# EAGLE design quantizer2_v10 (EAGLE 9.6.2)

## Sheet 1 of 2
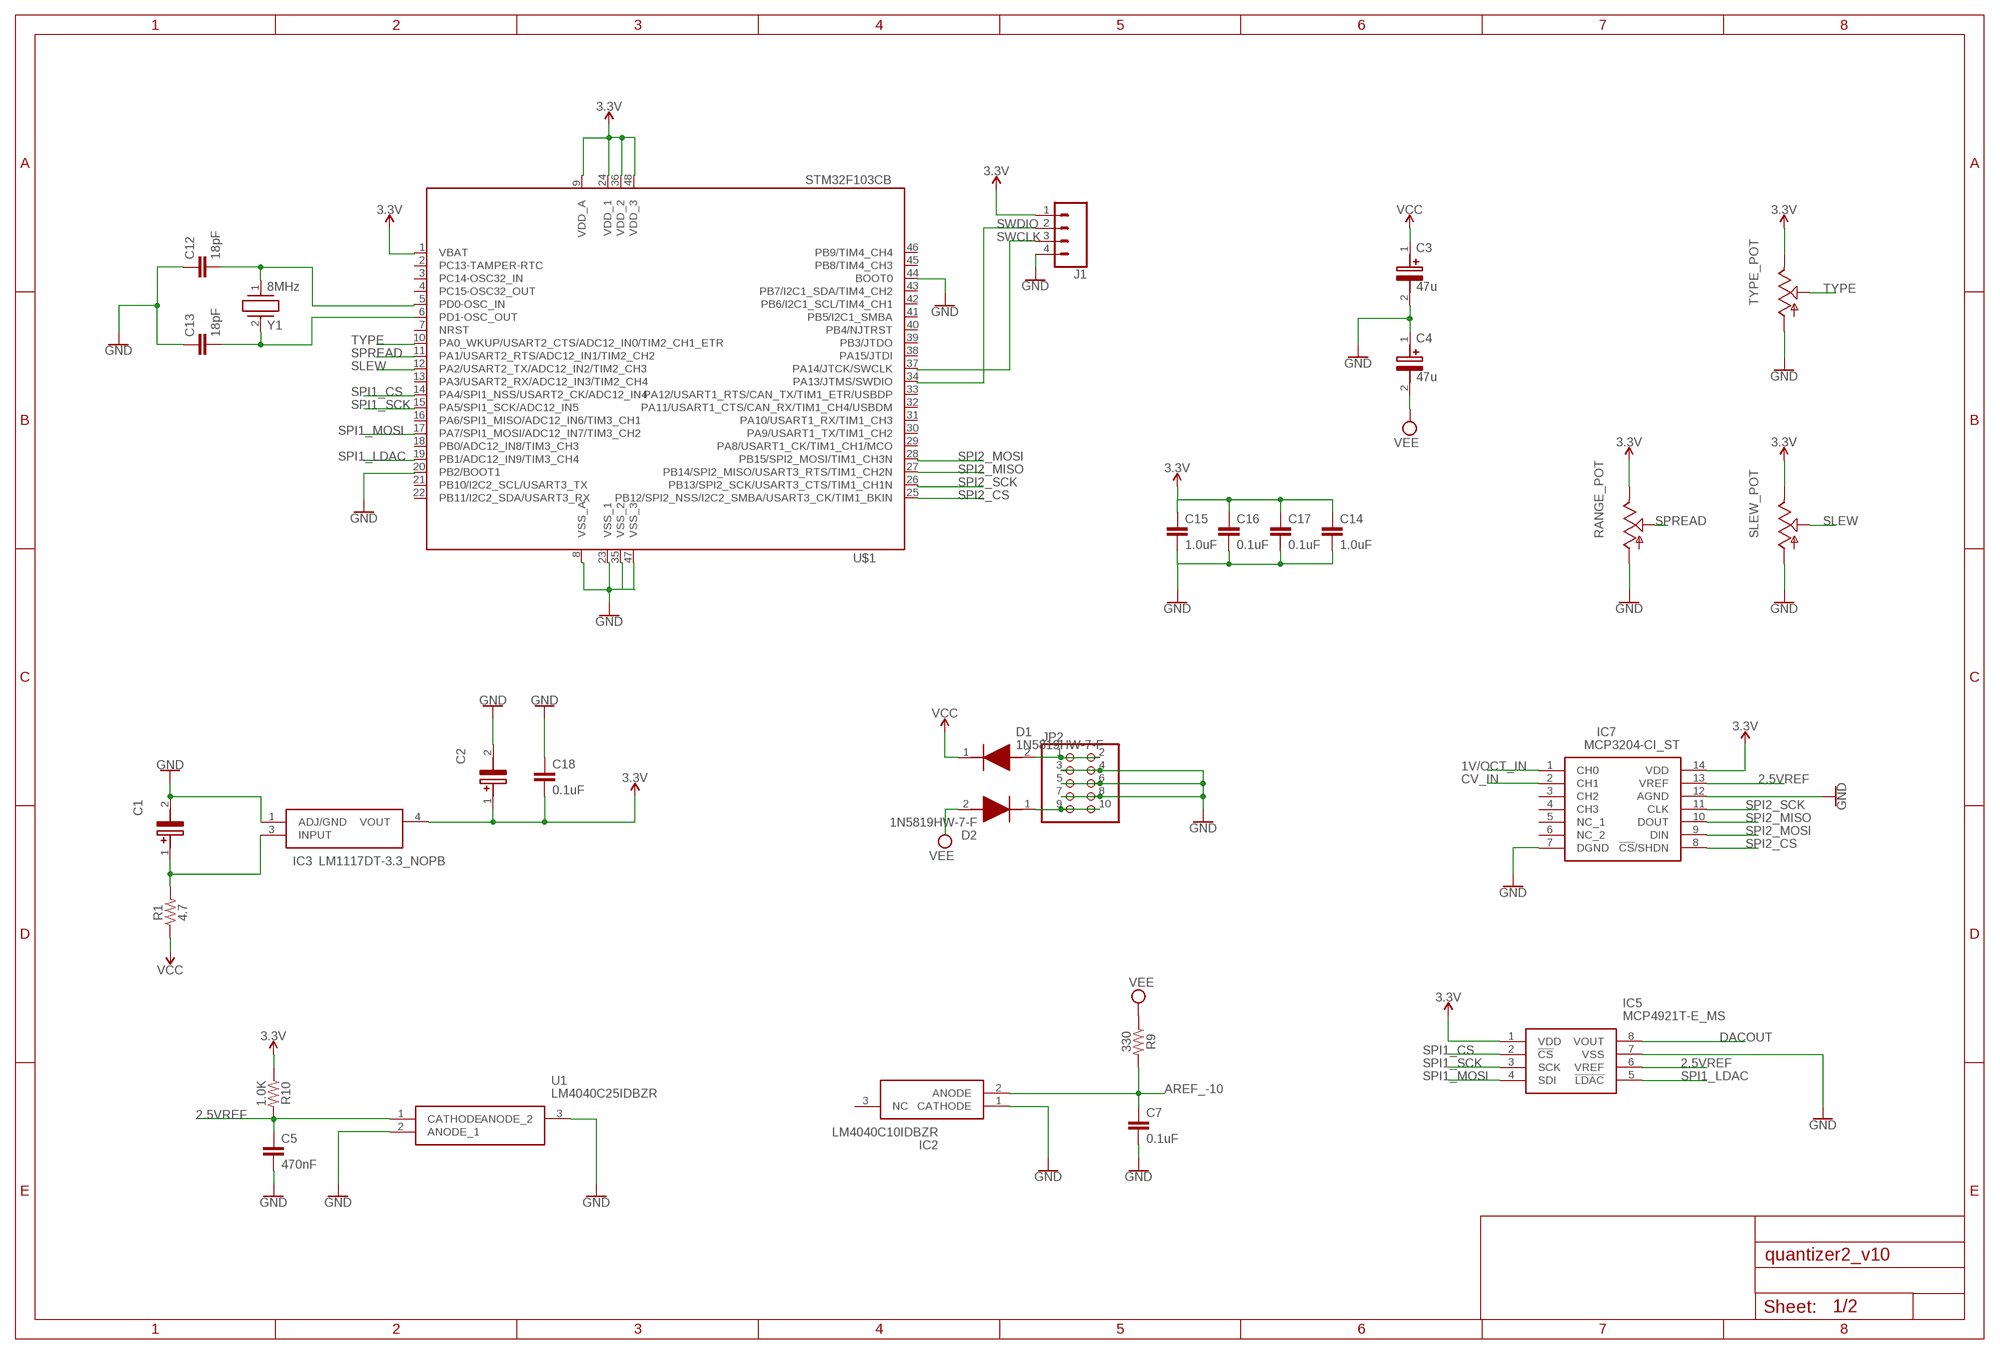
[diagram p0: schematic, sheet 1]

### Parts
C1  22uF  EEE-FP1E220AR  [EEE0GA101SR]
C2  22uF  EEE-FP1E220AR  [EEE0GA101SR]
C3  47u  EEE-FK1V470P  [EEE1AA101SP]
C4  47u  EEE-FK1V470P  [EEE1AA101SP]
C5  470nF  0.1UF-0603-25V-(+80/-20%)  [0603]
C7  0.1uF  0.1UF-0603-25V-(+80/-20%)  [0603]
C12  18pF  18PF-0603-50V-5%  [0603]
C13  18pF  18PF-0603-50V-5%  [0603]
C14  1.0uF  1.0UF-0603-16V-10%  [0603]
C15  1.0uF  1.0UF-0603-16V-10%  [0603]
C16  0.1uF  0.1UF-0603-25V-(+80/-20%)  [0603]
C17  0.1uF  0.1UF-0603-25V-(+80/-20%)  [0603]
C18  0.1uF  0.1UF-0603-25V-(+80/-20%)  [0603]
D1  1N5819HW-7-F  [SOD3716X145N]
D2  1N5819HW-7-F  [SOD3716X145N]
IC2  LM4040C10IDBZR  [SOT95P237X112-3N]
IC3  LM1117DT-3.3_NOPB  [TO228P991X238-3N]
IC5  MCP4921T-E_MS  [SOP65P490X110-8N]
IC7  MCP3204-CI_ST  [SOP65P640X120-14N]
J1  CONN_04  [1X04]
JP2  PINHD-2X5  [2X05]
R1  4.7  RESISTOR1206  [1206]
R9  330  RESISTOR0603  [0603]
R10  1.0K  RESISTOR0603  [0603]
RANGE_POT  POT_USVERTICAL_PS  [ALPS_POT_VERTICAL_PS]
SLEW_POT  POTENTIOMETER-ALPHA-9MM_VERTICAL_  [POTENTIOMETER-ALPHA-9MM_VERTICAL]
TYPE_POT  POT_USVERTICAL_PS  [ALPS_POT_VERTICAL_PS]
U1  LM4040C25IDBZR  [SOT95P237X112-3N]
U$1  STM32F103CB  [LQFP48]
Y1  8MHz  ABLS3-8.000MHZ-D4Y-T  [ABLS]

### Nets
1V/OCT_IN: IC7.1(CH0) ; also sheet 2
2.5VREF: C5.1 IC5.6(VREF) IC7.13(VREF) R10.2 U1.1(CATHODE)
3.3V: C2.1(+) C18.2 IC3.4(VOUT) IC5.1(VDD) IC7.14(VDD) J1.1 R10.1 RANGE_POT.P$1(E) SLEW_POT.3(E) TYPE_POT.P$1(E) U$1.1(VBAT) U$1.9(VDD_A) U$1.24(VDD_1) U$1.36(VDD_2) U$1.48(VDD_3)
AREF_-10: C7.1 IC2.2(ANODE) R9.2 ; also sheet 2
CV_IN: IC7.2(CH1)
DACOUT: IC5.8(VOUT) ; also sheet 2
GND: C1.2(-) C2.2(-) C3.2(-) C4.1(+) C5.2 C7.2 C12.1 C13.1 C18.1 IC2.1(CATHODE) IC3.1(ADJ/GND) IC5.7(VSS) IC7.7(DGND) IC7.12(AGND) J1.4 JP2.3 JP2.4 JP2.5 JP2.6 JP2.7 JP2.8 RANGE_POT.P$3(A) SLEW_POT.1(A) TYPE_POT.P$3(A) U1.2(ANODE_1) U1.3(ANODE_2) U$1.8(VSS_A) U$1.20(PB2/BOOT1) U$1.23(VSS_1) U$1.35(VSS_2) U$1.44(BOOT0) U$1.47(VSS_3) ; also sheet 2
N$2: C1.1(+) IC3.3(INPUT) R1.2
N$4: D1.2(A) JP2.1 JP2.2
N$6: D2.1(K) JP2.9 JP2.10
N$10: C12.2 U$1.5(PD0-OSC_IN) Y1.1
N$11: C13.2 U$1.6(PD1-OSC_OUT) Y1.2
N$12: C14.1 C15.1 C16.1 C17.1 ; supply symbol labelled 3.3V
N$14: C14.2 C15.2 C16.2 C17.2 ; supply symbol labelled GND
SLEW: SLEW_POT.2(S) U$1.12(PA2/USART2_TX/ADC12_IN2/TIM2_CH3)
SPI1_CS: IC5.2(!CS) U$1.14(PA4/SPI1_NSS/USART2_CK/ADC12_IN4)
SPI1_LDAC: IC5.5(!LDAC) U$1.19(PB1/ADC12_IN9/TIM3_CH4)
SPI1_MOSI: IC5.4(SDI) U$1.17(PA7/SPI1_MOSI/ADC12_IN7/TIM3_CH2)
SPI1_SCK: IC5.3(SCK) U$1.15(PA5/SPI1_SCK/ADC12_IN5)
SPI2_CS: IC7.8(!CS!/SHDN) U$1.25(PB12/SPI2_NSS/I2C2_SMBA/USART3_CK/TIM1_BKIN)
SPI2_MISO: IC7.10(DOUT) U$1.27(PB14/SPI2_MISO/USART3_RTS/TIM1_CH2N)
SPI2_MOSI: IC7.9(DIN) U$1.28(PB15/SPI2_MOSI/TIM1_CH3N)
SPI2_SCK: IC7.11(CLK) U$1.26(PB13/SPI2_SCK/USART3_CTS/TIM1_CH1N)
SPREAD: RANGE_POT.P$2(S) U$1.11(PA1/USART2_RTS/ADC12_IN1/TIM2_CH2)
SWCLK: J1.3 U$1.37(PA14/JTCK/SWCLK)
SWDIO: J1.2 U$1.34(PA13/JTMS/SWDIO)
TYPE: TYPE_POT.P$2(S) U$1.10(PA0_WKUP/USART2_CTS/ADC12_IN0/TIM2_CH1_ETR)
VCC: C3.1(+) D1.1(K) R1.1 ; also sheet 2
VEE: C4.2(-) D2.2(A) R9.1 ; also sheet 2
Unconnected: IC2.3(NC) IC7.3(CH2) IC7.4(CH3) IC7.5(NC_1) IC7.6(NC_2) U$1.2(PC13-TAMPER-RTC) U$1.3(PC14-OSC32_IN) U$1.4(PC15-OSC32_OUT) U$1.7(NRST) U$1.13(PA3/USART2_RX/ADC12_IN3/TIM2_CH4) U$1.16(PA6/SPI1_MISO/ADC12_IN6/TIM3_CH1) U$1.18(PB0/ADC12_IN8/TIM3_CH3) U$1.21(PB10/I2C2_SCL/USART3_TX) U$1.22(PB11/I2C2_SDA/USART3_RX) U$1.29(PA8/USART1_CK/TIM1_CH1/MCO) U$1.30(PA9/USART1_TX/TIM1_CH2) U$1.31(PA10/USART1_RX/TIM1_CH3) U$1.32(PA11/USART1_CTS/CAN_RX/TIM1_CH4/USBDM) U$1.33(PA12/USART1_RTS/CAN_TX/TIM1_ETR/USBDP) U$1.38(PA15/JTDI) U$1.39(PB3/JTDO) U$1.40(PB4/NJTRST) U$1.41(PB5/I2C1_SMBA) U$1.42(PB6/I2C1_SCL/TIM4_CH1) U$1.43(PB7/I2C1_SDA/TIM4_CH2) U$1.45(PB8/TIM4_CH3) U$1.46(PB9/TIM4_CH4)

## Sheet 2 of 2
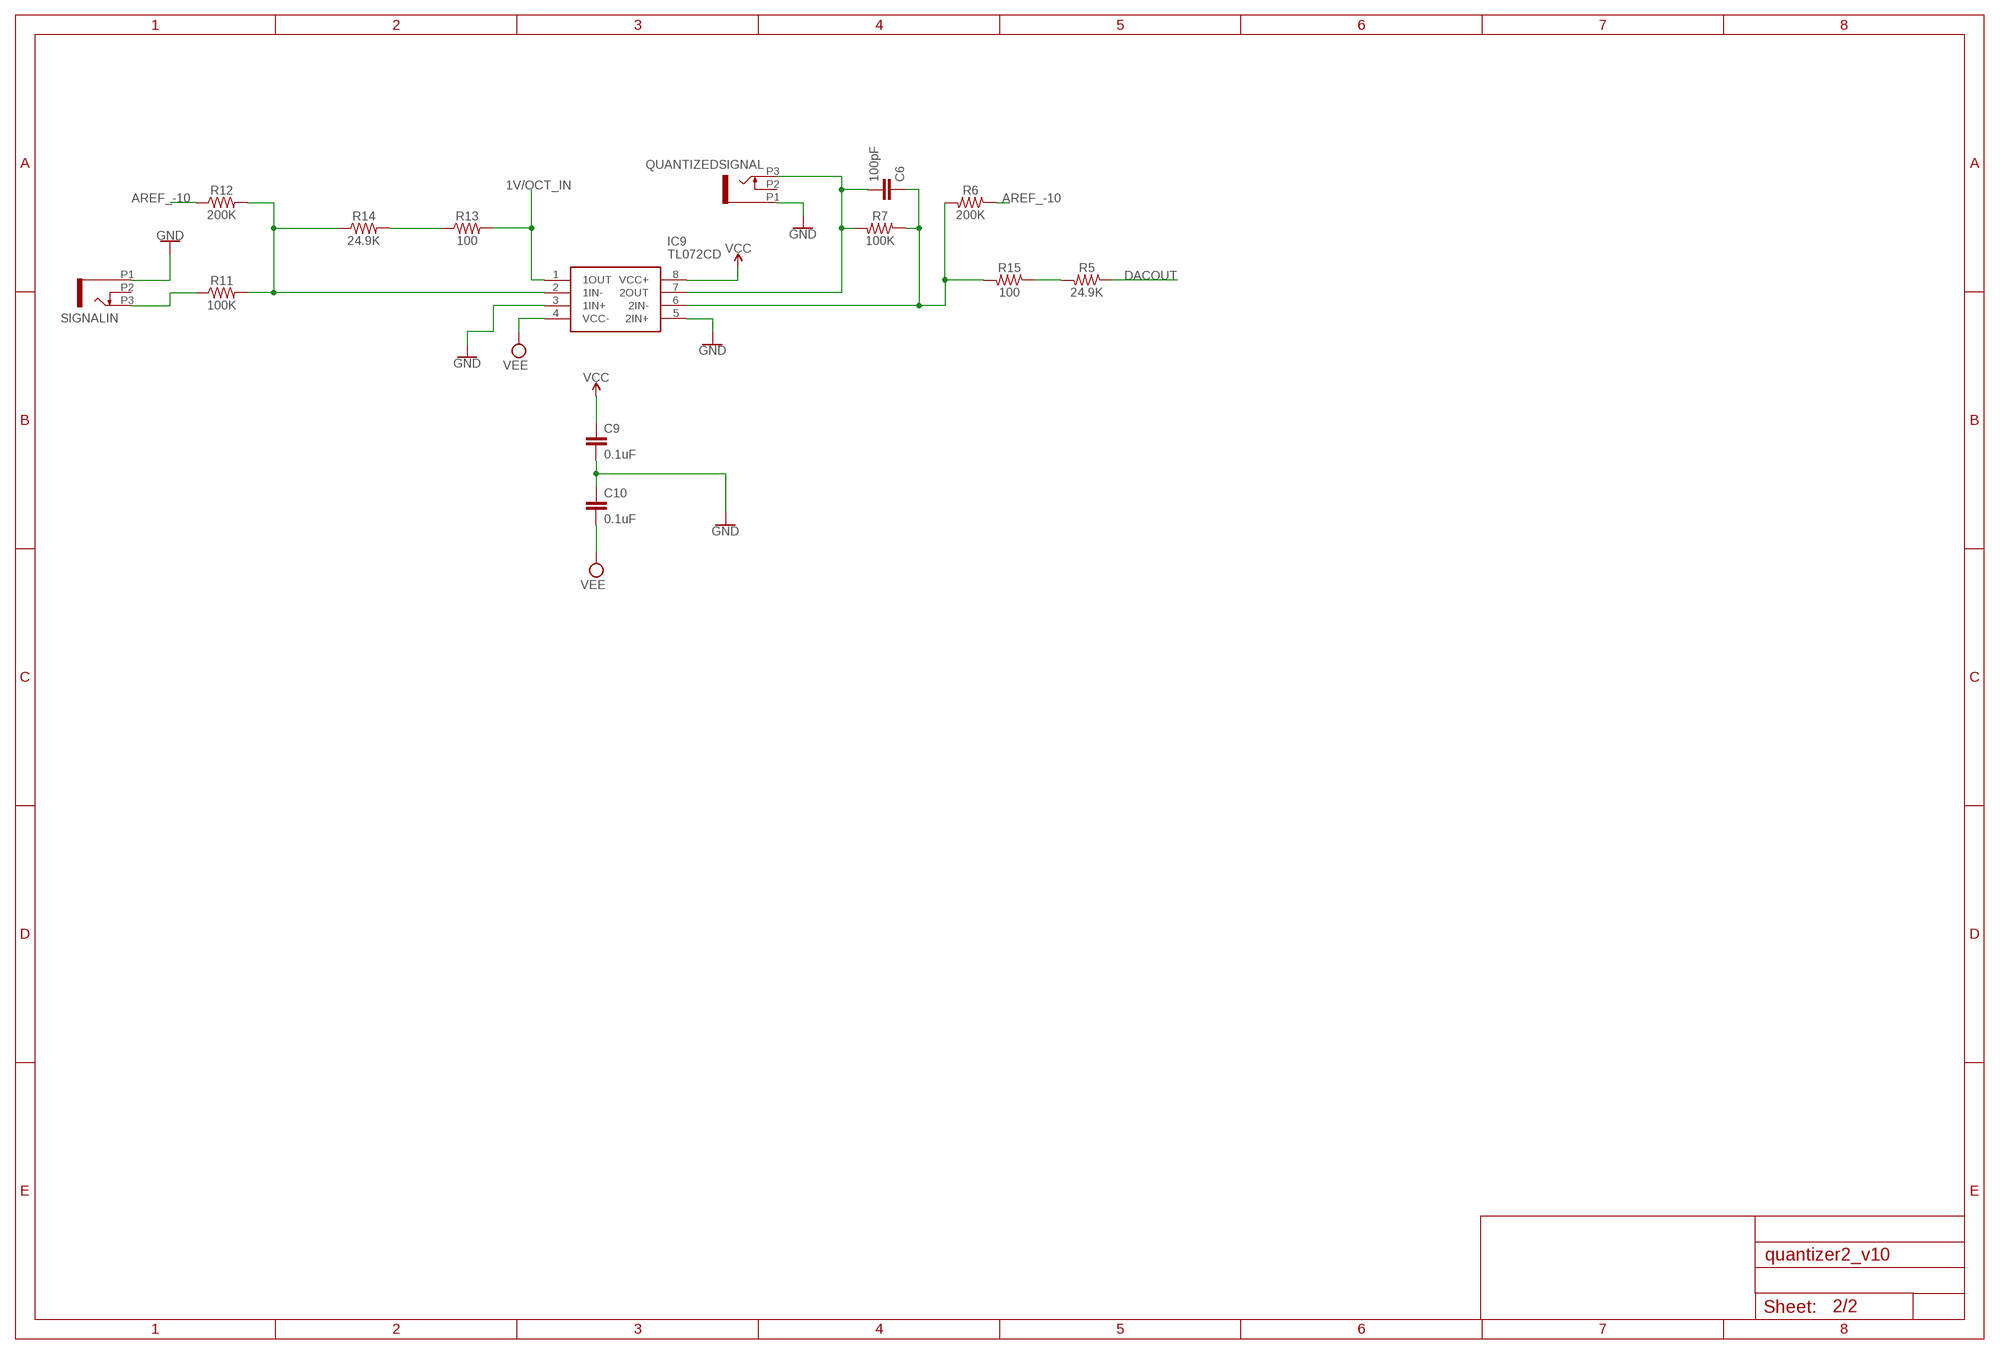
[diagram p1: schematic, sheet 2]

### Parts
C6  100pF  0.1UF-0603-25V-(+80/-20%)  [0603]
C9  0.1uF  0.1UF-0603-25V-(+80/-20%)  [0603]
C10  0.1uF  0.1UF-0603-25V-(+80/-20%)  [0603]
IC9  TL072CD  [SOIC127P600X175-8N]
QUANTIZEDSIGNAL  PJ301_THONKICONN6  [WQP_PJ_301M6]
R5  24.9K  RESISTOR0603  [0603]
R6  200K  RESISTOR0603  [0603]
R7  100K  RESISTOR0603  [0603]
R11  100K  RESISTOR0603  [0603]
R12  200K  RESISTOR0603  [0603]
R13  100  RESISTOR0603  [0603]
R14  24.9K  RESISTOR0603  [0603]
R15  100  RESISTOR0603  [0603]
SIGNALIN  PJ301_THONKICONN6  [WQP_PJ_301M6]

### Nets
1V/OCT_IN: IC9.1(1OUT) R13.2 ; also sheet 1
AREF_-10: R6.1 R12.1 ; also sheet 1
DACOUT: R5.1 ; also sheet 1
GND: C9.2 C10.1 IC9.3(1IN+) IC9.5(2IN+) QUANTIZEDSIGNAL.P1 SIGNALIN.P1 ; also sheet 1
N$5: R11.1 SIGNALIN.P3
N$8: IC9.2(1IN-) R11.2 R12.2 R14.1
N$13: C6.2 IC9.7(2OUT) QUANTIZEDSIGNAL.P3 R7.2
N$15: R13.1 R14.2
N$16: R5.2 R15.1
N$17: C6.1 IC9.6(2IN-) R6.2 R7.1 R15.2
VCC: C9.1 IC9.8(VCC+) ; also sheet 1
VEE: C10.2 IC9.4(VCC-) ; also sheet 1
Unconnected: QUANTIZEDSIGNAL.P2 SIGNALIN.P2

## Library data of the parts
C1 C2 = EEE-FP1E220AR:EEE-FP1E220AR: PANASONIC - EEEFP1E220AR - SMD Aluminium Electrolytic Capacitor, Radial Can - SMD, 22 F, 25 V, 0.36 ohm, FP Series Source: Datasheet <http://industrial.panasonic.com/cdbs/www-data/pdf/RDE0000/ABA0000C1184.pdf>; DESCRIPTION: PANASONIC - EEEFP1E220AR - SMD Aluminium Electrolytic Capacitor, Radial Can - SMD, 22 F, 25 V, 0.36 ohm, FP Series; HEIGHT: 6.5mm; MANUFACTURER_NAME: Panasonic; MANUFACTURER_PART_NUMBER: EEE-FP1E220AR; MOUSER_PART_NUMBER: 667-EEE-FP1E220AR; MOUSER_PRICE-STOCK: https://www.mouser.co.uk/ProductDetail/Panasonic/EEE-FP1E220AR?qs=d1CqaRUMZD%252ByxlCLn0gmaw%3D%3D
C3 C4 = EEE-FK1V470P:EEE-FK1V470P: Aluminum Electrolytic Capacitors - SMD 47uF 35V Source: Datasheet <http://industrial.panasonic.com/cdbs/www-data/pdf/RDE0000/ABA0000C1181.pdf>; DESCRIPTION: Aluminum Electrolytic Capacitors - SMD 47uF 35V; HEIGHT: 7.8mm; MANUFACTURER_NAME: Panasonic; MANUFACTURER_PART_NUMBER: EEE-FK1V470P; MOUSER_PART_NUMBER: 667-EEE-FK1V470P; MOUSER_PRICE-STOCK: https://www.mouser.co.uk/ProductDetail/Panasonic/EEE-FK1V470P?qs=qE6bgDGEOCuVUX5CkiabHQ%3D%3D
C5 C6 = SparkFun-Capacitors:0.1UF: 0.1µF ceramic capacitors A capacitor is a passive two-terminal electrical component used to store electrical energy temporarily in an electric field.; PROD_ID: CAP-00810; VALUE: 0.1uF
C7 C9 C10 C16-C18 = SparkFun-Capacitors:0.1UF: 0.1µF ceramic capacitors A capacitor is a passive two-terminal electrical component used to store electrical energy temporarily in an electric field.; PROD_ID: CAP-00810
C12 C13 = SparkFun-Capacitors:18PF: 18pF ceramic capacitors A capacitor is a passive two-terminal electrical component used to store electrical energy temporarily in an electric field.; PROD_ID: CAP-08267
C14 C15 = SparkFun-Capacitors:1.0UF: 1µF ceramic capacitors A capacitor is a passive two-terminal electrical component used to store electrical energy temporarily in an electric field.; PROD_ID: CAP-00868
D1 D2 = 1N5819HW-7-F:1N5819HW-7-F: Diode Schottky 1A 40V SOD123 Diodes Inc 1N5819HW-7-F, SMT Schottky Diode, 40V 1A, 2-Pin SOD-123 Source: Datasheet <https://datasheet.datasheetarchive.com/originals/distributors/Datasheets-DGA23/1390892.pdf>; DESCRIPTION: Diode Schottky 1A 40V SOD123 Diodes Inc 1N5819HW-7-F, SMT Schottky Diode, 40V 1A, 2-Pin SOD-123; HEIGHT: 1.45mm; MANUFACTURER_NAME: Diodes Inc.; MANUFACTURER_PART_NUMBER: 1N5819HW-7-F; MOUSER_PART_NUMBER: 621-1N5819HW-F; MOUSER_PRICE-STOCK: https://www.mouser.co.uk/ProductDetail/Diodes-Incorporated/1N5819HW-7-F?qs=NQ47qNm99eDyWTEd07miYA%3D%3D
IC2 = LM4040C10IDBZR:LM4040C10IDBZR: PRECISION MICROPOWER SHUNT VOLTAGE REFERENCE Source: Datasheet <http://www.ti.com/lit/gpn/lm4040>; DESCRIPTION: PRECISION MICROPOWER SHUNT VOLTAGE REFERENCE; HEIGHT: mm; MANUFACTURER_NAME: Texas Instruments; MANUFACTURER_PART_NUMBER: LM4040C10IDBZR; MOUSER_PART_NUMBER: 595-LM4040C10IDBZR; MOUSER_PRICE-STOCK: https://www.mouser.com/Search/Refine.aspx?Keyword=595-LM4040C10IDBZR
IC3 = LM1117DT-3.3_NOPB:LM1117DT-3.3_NOPB: Space saving 800-mA low-dropout linear regulator with internal current limit Source: Datasheet <https://datasheet.datasheetarchive.com/originals/distributors/Datasheets-SFU2/DSASFU100036103.pdf>; DESCRIPTION: Space saving 800-mA low-dropout linear regulator with internal current limit; HEIGHT: 2.38mm; MANUFACTURER_NAME: Texas Instruments; MANUFACTURER_PART_NUMBER: LM1117DT-3.3/NOPB; MOUSER_PART_NUMBER: 926-LM1117DT-3.3NOPB; MOUSER_PRICE-STOCK: https://www.mouser.co.uk/ProductDetail/Texas-Instruments/LM1117DT-3.3-NOPB?qs=X1J7HmVL2ZHOT670myqy2w%3D%3D
IC5 = MCP4921T-E_MS:MCP4921T-E_MS: Digital to Analog Converters - DAC Sgl 12-bit SPI int Source: Datasheet <http://www.microchip.com/mymicrochip/filehandler.aspx?ddocname=en547911>; DESCRIPTION: Digital to Analog Converters - DAC Sgl 12-bit SPI int; HEIGHT: 1.1mm; MANUFACTURER_NAME: Microchip; MANUFACTURER_PART_NUMBER: MCP4921T-E/MS; MOUSER_PART_NUMBER: 579-MCP4921T-E/MS; MOUSER_PRICE-STOCK: https://www.mouser.co.uk/ProductDetail/Microchip-Technology/MCP4921T-E-MS?qs=fM4xO01eazMZI7WjXZqD2A%3D%3D
IC7 = MCP3204-CI_ST:MCP3204-CI_ST: 4-Ch 12-Bit ADC 2.7V SPI TSSOP14 Microchip MCP3204-CI/ST, 12 bit Serial ADC,, 14-Pin TSSOP Source: Datasheet <http://www.microchip.com/wwwproducts/en/MCP3204>; DESCRIPTION: 4-Ch 12-Bit ADC 2.7V SPI TSSOP14 Microchip MCP3204-CI/ST, 12 bit Serial ADC,, 14-Pin TSSOP; HEIGHT: 1.2mm; MANUFACTURER_NAME: Microchip; MANUFACTURER_PART_NUMBER: MCP3204-CI/ST; MOUSER_PART_NUMBER: 579-MCP3204-CI/ST; MOUSER_PRICE-STOCK: https://www.mouser.co.uk/ProductDetail/Microchip-Technology/MCP3204-CI-ST?qs=9y3LFqDLL8Iux4kAt7A5qw%3D%3D
IC9 = TL072CD:TL072CD: Dual Low-Noise JFET-Input General-Purpose Operational Amplifier Source: Datasheet <http://www.ti.com/lit/ds/symlink/tl072.pdf>; DESCRIPTION: Dual Low-Noise JFET-Input General-Purpose Operational Amplifier; HEIGHT: 1.75mm; MANUFACTURER_NAME: Texas Instruments; MANUFACTURER_PART_NUMBER: TL072CD; MOUSER_PART_NUMBER: 595-TL072CD; MOUSER_PRICE-STOCK: https://www.mouser.co.uk/ProductDetail/Texas-Instruments/TL072CD?qs=5nGYs9Do7G0niDPig1J2Tw%3D%3D
J1 = SparkFun-Connectors:CONN_04: Multi connection point. Often used as Generic Header-pin footprint for 0.1 inch spaced/style header connections On any of the 0.1 inch spaced packages, you can populate with these: Break Away Headers - Straight <https://www.sparkfun.com/products/116> (PRT-00116) Break Away Male Headers - Right Angle <https://www.sparkfun.com/products/553> (PRT-00553) Female Headers <https://www.sparkfun.com/products/115> (PRT-00115) Break Away Headers - Machine Pin <https://www.sparkfun.com/products/117> (PRT-00117) Break Away Female Headers - Swiss Machine Pin <https://www.sparkfun.com/products/743> (PRT-00743) For SCREWTERMINALS and SPRING TERMINALS visit here: Screw Terimnals on SparkFun.com <https://www.sparkfun.com/search/results?term=Screw+Terminals> (5mm/3.5mm/2.54mm spacing) This device is also useful as a general connection point to wire up your design to another part of your project. Our various solder wires solder well into these plated through hole pads. Hook-Up Wire - Assortment (Stranded, 22 AWG) <https://www.sparkfun.com/products/11375> (PRT-11375) Hook-Up Wire - Assortment (Solid Core, 22 AWG) <https://www.sparkfun.com/products/11367> (PRT-11367) View the entire wire category on our website here <https://www.sparkfun.com/categories/141> Special notes: Molex polarized connector foot print use with SKU : PRT-08231 with associated crimp pins and housings. 1MM SMD Version SKU: PRT-10208; PROD_ID: CONN-09696
JP2 = pinhead:PINHD-2X5: PIN HEADER
QUANTIZEDSIGNAL SIGNALIN = og-pj301_variations:PJ301_THONKICONN
R1 R5-R7 R9-R15 = SparkFun-Resistors:RESISTOR: Generic Resistor Package
RANGE_POT TYPE_POT = og-pots:POT_US
SLEW_POT = EURACK-MASTER-LIB:POTENTIOMETER-ALPHA-9MM_VERTICAL: 9mm vertical snap-in pot, Alpha / Panasonic style
U1 = LM4040C25IDBZR:LM4040C25IDBZR: TEXAS INSTRUMENTS - LM4040C25IDBZR - VOLTAGE REF, SHUNT, 2.5V, SOT-23-3 Source: Datasheet <https://datasheet.datasheetarchive.com/originals/distributors/Datasheets-DGA16/867624.pdf>; DESCRIPTION: TEXAS INSTRUMENTS - LM4040C25IDBZR - VOLTAGE REF, SHUNT, 2.5V, SOT-23-3; HEIGHT: 1.12mm; MANUFACTURER_NAME: Texas Instruments; MANUFACTURER_PART_NUMBER: LM4040C25IDBZR; MOUSER_PART_NUMBER: 595-LM4040C25IDBZR; MOUSER_PRICE-STOCK: https://www.mouser.co.uk/ProductDetail/Texas-Instruments/LM4040C25IDBZR?qs=VBduBm9rCJStNYDGENjZXg%3D%3D
U$1 = stm32:STM32F103CB
Y1 = ABLS3-8.000MHZ-D4Y-T:ABLS3-8.000MHZ-D4Y-T: HC49/US (AT49) LOW PROFILE SMD MICROPROCESSOR CRYSTAL Source: Datasheet <https://abracon.com/Resonators/abls.pdf>; DESCRIPTION: HC49/US (AT49) LOW PROFILE SMD MICROPROCESSOR CRYSTAL; HEIGHT: mm; MANUFACTURER_NAME: ABRACON; MANUFACTURER_PART_NUMBER: ABLS3-8.000MHZ-D4Y-T; MOUSER_PART_NUMBER: 815-ABLS3-8MD4YT; MOUSER_PRICE-STOCK: https://www.mouser.co.uk/ProductDetail/ABRACON/ABLS3-8000MHZ-D4Y-T?qs=WRzgYYgs9gC3im7pazpFGA%3D%3D

## Board
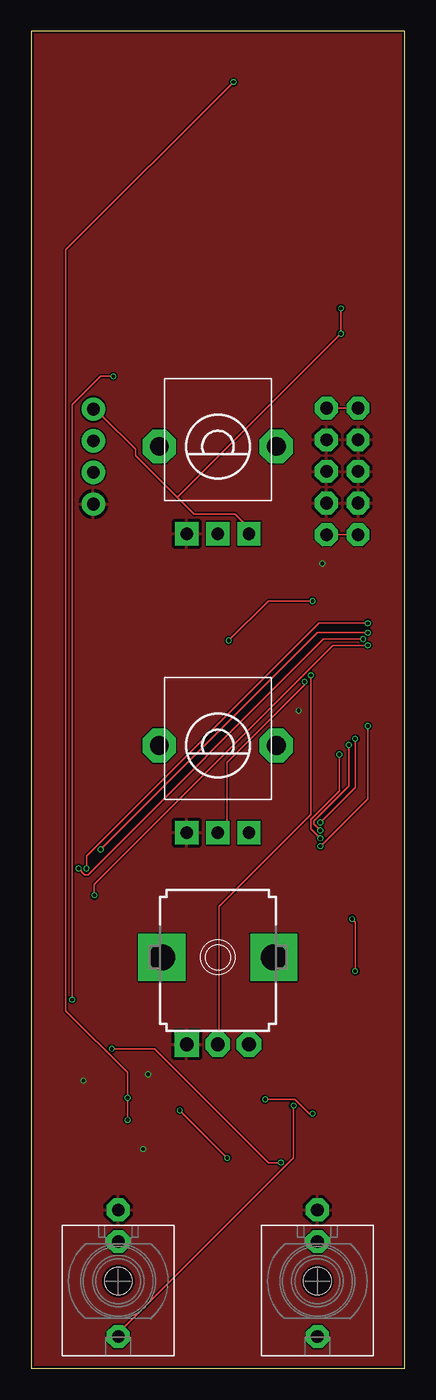
[diagram p2: board, top side]
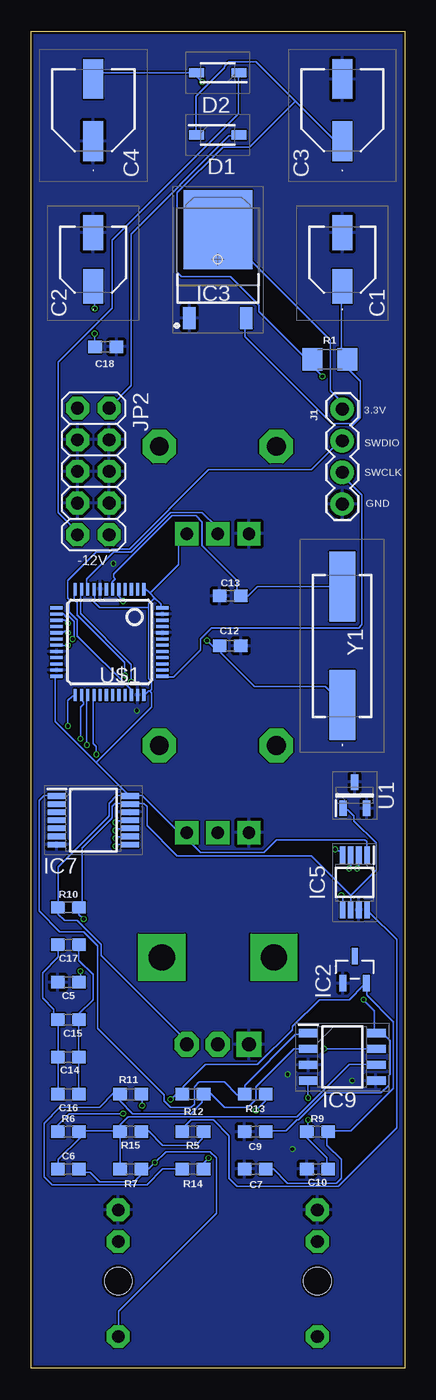
[diagram p3: board, bottom side, seen from below]

Size 30 x 107.34 mm. Coordinates in mm from the lower left corner, seen from the top.
Outline: 0,0 30,0 30,107.34 0,107.34 0,0
Copper layers (1*16): Top 0.035mm / dielectric 1.6mm / Bottom 0.035mm
Design rules "jlcpcb-2layers": minimum track width 5mil, minimum drill 0.3mm, track to track 5mil, track to pad 5mil, pad to pad 5mil, via to via 5mil, smd to smd 5mil, copper to edge 0.2mm, drill to drill 6mil, minimum pad ring 10mil, minimum via ring 3mil, stop-mask expansion 4mil, vias tented up to drill 0mil, thermal gap 10mil

### Footprints (pad centres in the part's own frame; a part is rotated, then mirrored left to right if it is on the bottom)
EEE0GA101SR = smd 2.8 x 1.6: 1 -2.15,0; 2 2.15,0
EEE1AA101SP = smd 3.2 x 1.6: 1 -2.5,0; 2 2.5,0
0603 = smd 1.1 x 1: 1 -0.85,0; 2 0.85,0
SOD3716X145N = smd 1.2 x 0.75: 1 -1.7,0; 2 1.7,0
SOT95P237X112-3N = smd 1.321 x 0.559: 1 -1.092,0.94; 2 -1.092,-0.94 | smd 1.321 x 0.508: 3 1.092,0
TO228P991X238-3N = smd 1.75 x 1: 1 -4.7,2.285; 3 -4.7,-2.285 | smd 6.35 x 5.55: 4 2.4,0
SOP65P490X110-8N = smd 1.4 x 0.45: 1 -2.2,0.975; 2 -2.2,0.325; 3 -2.2,-0.325; 4 -2.2,-0.975; 5 2.2,-0.975; 6 2.2,-0.325; 7 2.2,0.325; 8 2.2,0.975
SOP65P640X120-14N = smd 1.475 x 0.45: 1 -2.938,1.95; 2 -2.938,1.3; 3 -2.938,0.65; 4 -2.938,0; 5 -2.938,-0.65; 6 -2.938,-1.3; 7 -2.938,-1.95; 8 2.938,-1.95; 9 2.938,-1.3; 10 2.938,-0.65; 11 2.938,0; 12 2.938,0.65; 13 2.938,1.3; 14 2.938,1.95
SOIC127P600X175-8N = smd 1.528 x 0.65: 1 -2.711,1.905; 2 -2.711,0.635; 3 -2.711,-0.635; 4 -2.711,-1.905; 5 2.711,-1.905; 6 2.711,-0.635; 7 2.711,0.635; 8 2.711,1.905
1X04 = drill 1.016 pad 1.88: 1 0,0; 2 2.54,0; 3 5.08,0; 4 7.62,0
2X05 = drill 1.016 octagon: 1 -5.08,-1.27; 2 -5.08,1.27; 3 -2.54,-1.27; 4 -2.54,1.27; 5 0,-1.27; 6 0,1.27; 7 2.54,-1.27; 8 2.54,1.27; 9 5.08,-1.27; 10 5.08,1.27
WQP_PJ_301M6 = drill 1.016 pad 1.778 octagon: P1 0,-5.715; P2 0,-3.175; P3 0,4.445 | hole 2.2: 0,0
1206 = smd 1.6 x 1.8: 1 -1.4,0; 2 1.4,0
ALPS_POT_VERTICAL_PS = drill 1 pad 1.88 square: P$1 -2.5,7; P$2 0,7; P$3 2.5,7 | drill 1.5 pad 2.54 octagon: P$4 -4.7,0; P$5 4.7,0
POTENTIOMETER-ALPHA-9MM_VERTICAL = drill 1.1 pad 1.676 square: 1 -2.5,-7 | drill 1.1 pad 1.676 octagon: 2 0,-7; 3 2.5,-7 | drill 2.1 pad 2.8 square: M1 4.5,0; M2 -4.5,0
SOT95P237X112-3N' = smd 1.25 x 0.6: 1 -1.05,0.95; 2 -1.05,-0.95; 3 1.05,0
LQFP48 = smd 0.254 x 1: 1 -2.75,-4.25; 2 -2.25,-4.25; 3 -1.75,-4.25; 4 -1.25,-4.25; 5 -0.75,-4.25; 6 -0.25,-4.25; 7 0.25,-4.25; 8 0.75,-4.25; 9 1.25,-4.25; 10 1.75,-4.25; 11 2.25,-4.25; 12 2.75,-4.25; 25 2.75,4.25; 26 2.25,4.25; 27 1.75,4.25; 28 1.25,4.25; 29 0.75,4.25; 30 0.25,4.25; 31 -0.25,4.25; 32 -0.75,4.25; 33 -1.25,4.25; 34 -1.75,4.25; 35 -2.25,4.25; 36 -2.75,4.25 | smd 1 x 0.254: 13 4.25,-2.75; 14 4.25,-2.25; 15 4.25,-1.75; 16 4.25,-1.25; 17 4.25,-0.75; 18 4.25,-0.25; 19 4.25,0.25; 20 4.25,0.75; 21 4.25,1.25; 22 4.25,1.75; 23 4.25,2.25; 24 4.25,2.75; 37 -4.25,2.75; 38 -4.25,2.25; 39 -4.25,1.75; 40 -4.25,1.25; 41 -4.25,0.75; 42 -4.25,0.25; 43 -4.25,-0.25; 44 -4.25,-0.75; 45 -4.25,-1.25; 46 -4.25,-1.75; 47 -4.25,-2.25; 48 -4.25,-2.75
ABLS = smd 5.6 x 2.1: 1 -4.75,0; 2 4.75,0

### Placement (x,y rotation side)
C1  5,89 90 bottom
C2  25,89 90 bottom
C3  5,101 90 bottom
C4  25,101 90 bottom
C5  27,31 180 bottom
C6  27,16 0 bottom
C7  12,16 180 bottom
C9  12,19 180 bottom
C10  7,16 0 bottom
C12  14,58 180 bottom
C13  14,62 0 bottom
C14  27,25 180 bottom
C15  27,28 180 bottom
C16  27,22 180 bottom
C17  27,34 180 bottom
C18  24,82 180 bottom
D1  15,99 0 bottom
D2  15,104 180 bottom
IC2  4,32 90 bottom
IC3  15,89 90 bottom
IC5  4,39 270 bottom
IC7  25,44 0 bottom
IC9  5,25 0 bottom
J1  5,77 270 bottom
JP2  25,72 270 bottom
QUANTIZEDSIGNAL  23,7 180 top
R1  6,81 0 bottom
R5  17,19 0 bottom
R6  27,19 0 bottom
R7  22,16 0 bottom
R9  7,19 0 bottom
R10  27,37 0 bottom
R11  22,22 180 bottom
R12  17,22 0 bottom
R13  12,22 180 bottom
R14  17,16 0 bottom
R15  22,19 180 bottom
RANGE_POT  15,50 180 top
SIGNALIN  7,7 180 top
SLEW_POT  15,33 0 top
TYPE_POT  15,74 180 top
U1  LM4040C25IDBZR  [SOT95P237X112-3N']  4,46 90 bottom
U$1  23.7,58.3 180 bottom
Y1  5,58 90 bottom

### Tracks (layer width: path | path; a pad name or v marks a point on that pad's centre or on a via)
1V/OCT_IN
  Bottom 0.127: IC9.1 7.75,26.8 8.76,26.8 12.83,22.73 12.83,22.1 R13.2 12.95,21.97 13.46,21.97 14.48,22.99 16.51,22.99 16.89,22.61 16.89,21.21 17.14,20.95 18.8,20.95 19.3,21.46 19.3,21.97 24.64,27.3 24.64,33.91 25.78,35.05 27.69,35.05 29.34,36.7 29.34,45.59 28.96,45.97 27.94,45.97 IC7.1
2.5VREF  (via drill 0.3)
  Top 0.127: v26.04,31.88 26.04,35.81 v25.78,36.07
  Bottom 0.127: 4.32,37.97 2.29,40.01 2.29,42.16 4.06,43.94 4.06,44.32 4.57,44.83 4.83,44.83 U1.1 | 4.32,37.97 4.32,36.83 IC5.6 | v26.04,31.88 26.04,31.11 C5.1 | v25.78,36.07 26.16,36.45 26.16,36.96 R10.2 26.04,37.08 25.91,37.21 25.91,41.78 23.5,44.2 23.5,45.09 23.24,45.34 22.1,45.34 IC7.13 21.97,45.34 20.95,45.34 20.7,45.09 20.7,43.56 18.29,41.15 7.49,41.15 4.32,37.97
3.3V  (via drill 0.3)
  Top 0.127: v24.89,85.09 v24.89,83.06 11.81,69.98 11.68,69.98 | 11.68,69.98 13.08,68.58 16.38,68.58 17.4,67.56 17.4,67.06 TYPE_POT.P$1 | 11.68,69.98 8.38,73.28 8.38,73.79 5.71,76.45 5.59,76.45 5.08,76.96 J1.1
  Bottom 0.127: IC5.1 3.05,41.27 3.05,42.29 3.17,42.42 10.29,42.42 11.3,41.4 16.38,41.4 17.4,42.42 17.4,42.93 RANGE_POT.P$1 17.53,43.05 18.16,43.05 21.08,45.97 21.97,45.97 IC7.14 22.1,45.97 22.35,46.23 | 22.35,46.23 24.77,48.64 | 24.77,48.64 28.07,51.94 28.07,55.5 U$1.24 | 22.35,46.23 22.61,45.97 23.11,45.97 23.75,45.34 23.75,44.32 27.81,40.26 27.81,37.08 R10.1 27.81,36.96 27.81,36.45 27.3,35.94 26.29,35.94 24.38,34.04 24.38,33.15 17.53,26.29 17.53,26.04 SLEW_POT.3 | 20.45,62.23 20.83,62.61 U$1.1 | 20.45,62.23 20.07,61.85 | 20.07,61.85 19.56,61.34 19.56,61.09 U$1.48 | 20.45,54.36 20.57,54.36 20.83,54.1 U$1.36 | 20.45,54.36 20.32,54.48 20.32,55.12 20.57,55.37 20.57,61.09 | 20.57,61.09 20.57,61.34 20.07,61.85 | 20.57,61.09 24.51,61.09 25.02,61.59 24.89,61.72 24.89,61.98 25.02,62.1 25.02,62.48 U$1.9 | v24.89,83.06 24.89,82.04 C18.2 | v24.89,85.09 24.89,86.74 C2.1 | 20.45,62.23 18.16,64.52 18.16,66.29 17.53,66.93 TYPE_POT.P$1 | IC3.4 14.99,91.31 14.73,91.31 5.97,82.55 5.97,78.49 5.08,77.6 5.08,77.09 J1.1 | 24.77,48.64 20.32,53.09 20.32,54.23 20.45,54.36
AREF_-10  (via drill 0.3)
  Top 0.127: v22.61,20.45 22.35,20.45 21.21,21.59 v18.8,21.59
  Bottom 0.127: C7.1 11.05,16 10.54,16 9.4,14.86 5.46,14.86 5.08,15.24 5.08,16.76 6.22,17.91 6.22,18.92 R9.2 6.1,19.05 4.32,19.05 0.89,22.48 0.89,27.81 3.05,29.97 3.05,30.86 | 3.05,30.86 3.17,30.73 3.3,30.73 4.45,29.59 6.86,29.59 9.02,27.43 9.02,27.18 11.81,24.38 16,24.38 17.78,22.61 17.78,22.1 R12.1 17.91,21.97 18.41,21.97 v18.8,21.59 | v22.61,20.45 26.92,20.45 27.81,19.56 27.81,19.05 R6.1 | 3.05,30.86 IC2.2
DACOUT
  Bottom 0.127: R5.1 17.78,19.05 17.78,19.3 17.14,19.94 15.37,19.94 14.1,18.67 14.1,15.24 13.46,14.61 5.33,14.61 0.64,19.3 0.64,34.42 2.79,36.58 2.92,36.58 3.05,36.7 IC5.8
GND  (via drill 0.3)
  other vias: 9,17.6 9.4,23.6 4.2,23.1 21.5,52.8 23.4,64.6
  pour Top: 0,107.3 30,107.3 30,0 0,0
  pour Bottom: 0,107.3 30,107.3 30,0 0,0
N$2
  Bottom 0.127: IC3.3 12.83,84.2 12.83,82.8 5.84,75.82 4.32,75.82 4.19,75.69 3.56,76.33 3.56,79.25 4.57,80.26 4.57,80.9 R1.2 4.7,81.03 5.08,81.41 5.08,86.74 C1.1
N$4
  Top 0.127: JP2.1 26.16,77.09 23.75,77.09 JP2.2
  Bottom 0.127: D1.2 13.34,98.93 14.1,98.93 21.97,91.06 21.97,78.87 23.75,77.09 JP2.2
N$5  (via drill 0.3)
  Top 0.127: v21.08,21.08 21.08,16.89 7.11,2.92 7.11,2.67 SIGNALIN.P3
  Bottom 0.127: v21.08,21.08 21.08,21.97 R11.1
N$6
  Top 0.127: JP2.10 23.75,66.93 26.16,66.93 JP2.9
  Bottom 0.127: D2.1 13.34,103.89 13.34,100.71 23.5,90.55 23.5,85.09 27.81,80.77 27.81,68.71 26.29,67.18 26.29,66.93 JP2.9
N$8
  Bottom 0.127: R14.1 17.91,16 19.43,16 20.7,14.73 28.32,14.73 28.96,15.37 28.96,19.68 27.69,20.95 24.51,20.95 23.37,22.1 22.86,22.1 R11.2 22.86,21.97 22.86,21.46 21.84,20.45 17.14,20.45 16.26,21.34 16.26,21.97 R12.2 16.13,22.1 15.62,22.1 14.48,20.95 12.57,20.95 11.94,21.59 11.94,22.61 8.89,25.65 7.75,25.65 IC9.2
N$10  (via drill 0.3)
  Top 0.127: v22.61,61.59 19.05,61.59 v15.88,58.42
  Bottom 0.127: v22.61,61.59 22.99,61.98 22.99,62.48 U$1.5 | v15.88,58.42 15.37,57.91 14.86,57.91 C12.2 14.73,57.91 14.73,57.4 12.06,54.74 6.35,54.74 4.95,53.34 Y1.1
N$11
  Bottom 0.127: U$1.6 23.5,62.61 23.5,63.12 23.24,63.37 23.37,63.5 23.37,63.75 18.67,68.45 16.76,68.45 16.26,67.94 16.26,66.04 13.46,63.25 13.46,62.36 13.21,62.1 C13.2 13.08,61.98 12.57,61.98 11.81,62.74 5.08,62.74 Y1.2
N$12
  Bottom 0.127: C16.1 26.16,22.1 26.16,24.89 C14.1 26.16,25.02 26.16,27.94 C15.1 26.16,28.07 26.16,28.45 25.02,29.59 25.02,31.62 26.16,32.77 26.16,33.91 C17.1
N$13  (via drill 0.3)
  Top 0.127: v6.48,25.65 9.91,25.65 19.05,16.51 v20.07,16.51
  Bottom 0.127: C6.2 26.04,15.88 25.91,15.75 25.27,15.75 24.51,14.99 21.72,14.99 21.21,15.49 21.21,15.88 R7.2 21.08,16 20.57,16 v20.07,16.51 19.18,17.4 15.62,17.4 15.11,16.89 15.11,12.45 22.99,4.57 22.99,2.67 QUANTIZEDSIGNAL.P3 | v6.48,25.65 2.41,25.65 IC9.7
N$14
  Bottom 0.127: C16.2 27.81,22.1 27.81,24.89 C14.2 27.81,25.02 27.81,27.94 C15.2 27.94,28.07 28.19,28.32 28.19,28.83 29.08,29.72 29.08,31.75 27.81,33.02 27.81,33.91 C17.2
N$15  (via drill 0.3)
  Top 0.127: v15.75,16.89 v11.94,20.7
  Bottom 0.127: v11.94,20.7 11.18,21.46 11.18,21.97 R13.1 | v15.75,16.89 16.13,16.51 16.13,16 R14.2
N$16
  Bottom 0.127: R5.2 16.26,18.92 16.26,18.41 16.76,17.91 19.43,17.91 20.57,19.05 21.08,19.05 R15.1
N$17
  Bottom 0.127: R7.1 22.86,18.92 R15.2 22.86,19.05 | 22.86,19.05 26.04,19.05 R6.2 26.04,18.92 26.04,18.54 27.81,16.76 27.81,16 C6.1 | 22.86,19.05 22.86,19.56 22.23,20.19 8.64,20.19 4.45,24.38 2.41,24.38 IC9.6
SLEW  (via drill 0.3)
  Top 0.127: v22.48,55.63 22.48,44.45 15.11,37.08 15.11,26.04 SLEW_POT.2
  Bottom 0.127: v22.48,55.63 22.48,56.64 26.29,60.45 26.29,61.47 26.54,61.72 26.54,61.98 26.42,62.1 26.42,62.48 U$1.12
SPI1_CS  (via drill 0.3)
  Top 0.127: v26.67,58.55 23.5,58.55 4.57,39.62 4.32,39.62 v3.81,40.13
  Bottom 0.127: v26.67,58.55 26.54,58.67 26.54,59.94 27.05,60.45 27.18,60.33 27.43,60.58 27.94,60.58 U$1.14 | v3.81,40.13 3.68,40.26 3.68,41.15 IC5.2
SPI1_LDAC  (via drill 0.3)
  Top 0.127: v27.05,58.04 24.26,58.04 5.08,38.86 v5.08,37.97
  Bottom 0.127: v27.05,58.04 U$1.19 | v5.08,37.97 4.95,37.85 4.95,36.83 IC5.5
SPI1_MOSI  (via drill 0.3)
  Top 0.127: v27.05,59.05 22.99,59.05 v5.59,41.66
  Bottom 0.127: v27.05,59.05 27.18,59.18 27.3,59.18 27.43,59.05 U$1.17 | v5.59,41.66 5.46,41.53 5.08,41.53 4.95,41.4 4.95,41.27 IC5.4
SPI1_SCK  (via drill 0.3)
  Top 0.127: v27.05,59.82 23.11,59.82 4.45,41.15 v4.45,40.13
  Bottom 0.127: v27.05,59.82 27.3,60.07 27.94,60.07 U$1.15 | v4.45,40.13 4.32,40.26 4.32,41.15 IC5.3
SPI2_CS  (via drill 0.3)
  Top 0.127: v27.05,51.56 27.05,45.72 v23.24,41.91
  Bottom 0.127: v27.05,51.56 27.05,53.59 26.67,53.98 26.54,53.98 U$1.25 | v23.24,41.91 23.11,42.04 22.1,42.04 IC7.8
SPI2_MISO  (via drill 0.3)
  Top 0.127: v25.53,50.04 25.53,46.74 22.73,43.94 22.73,43.69 v23.24,43.18
  Bottom 0.127: v25.53,50.04 25.53,53.98 U$1.27 | v23.24,43.18 23.11,43.31 22.1,43.31 IC7.10
SPI2_MOSI  (via drill 0.3)
  Top 0.127: v24.77,49.28 24.77,46.35 22.48,44.07 22.48,43.31 v23.24,42.55
  Bottom 0.127: v24.77,49.28 24.77,49.91 25.02,50.16 25.02,53.98 U$1.28 | v23.24,42.55 23.11,42.67 22.1,42.67 IC7.9
SPI2_SCK  (via drill 0.3)
  Top 0.127: v26.04,50.55 26.04,46.61 v23.24,43.81
  Bottom 0.127: v26.04,50.55 26.04,53.09 25.78,53.34 25.78,53.47 25.91,53.59 25.91,53.98 U$1.26 | v23.24,43.81 23.11,43.94 22.1,43.94 IC7.11
SPREAD  (via drill 0.3)
  Top 0.127: v21.97,55.12 21.97,54.86 15.75,48.64 15.75,43.69 15.11,43.05 RANGE_POT.P$2
  Bottom 0.127: v21.97,55.12 21.97,56.52 26.04,60.58 26.04,62.48 U$1.11
SWCLK
  Bottom 0.127: U$1.37 19.43,55.5 18.54,55.5 16.38,57.66 16.38,58.55 15.49,59.44 3.68,59.44 3.43,59.69 3.43,70.1 4.95,71.63 4.95,71.88 J1.3
SWDIO
  Bottom 0.127: U$1.34 21.97,54.1 21.97,54.48 26.29,58.8 26.29,60.07 26.92,60.71 26.92,61.72 27.05,61.85 27.05,63.25 24.77,65.53 23.75,65.53 23.5,65.79 22.1,65.79 15.75,72.14 7.49,72.14 5.08,74.55 J1.2
TYPE
  Bottom 0.127: U$1.10 25.53,62.61 25.53,63.37 23.37,65.53 21.97,65.53 18.8,68.71 16.26,68.71 15.11,67.56 15.11,67.06 TYPE_POT.P$2
VCC  (via drill 0.3)
  Top 0.127: v3.3,29.59 3.3,77.34 5.59,79.63 v6.6,79.63
  Bottom 0.127: C9.1 11.05,19.05 9.53,19.05 8.64,19.94 8.51,19.94 6.35,22.1 1.91,22.1 1.27,22.73 1.27,23.5 1.14,23.62 1.14,26.29 1.65,26.8 2.29,26.8 IC9.8 2.41,26.92 2.41,28.7 v3.3,29.59 | 8.76,101.73 5.59,98.55 5.08,98.55 C3.1 | 8.76,101.73 11.94,104.9 14.1,104.9 14.48,104.52 14.48,104.39 16.76,102.11 16.76,99.06 D1.1 | 8.76,101.73 12.45,98.04 14.61,98.04 18.29,94.36 18.29,88.01 17.91,87.63 13.97,87.63 11.68,85.34 11.68,84.84 7.87,81.03 7.49,81.03 R1.1 7.37,80.9 7.37,80.39 v6.6,79.63
VEE  (via drill 0.3)
  Top 0.127: v7.75,19.94 v7.75,21.72 7.75,23.75 2.79,28.7 2.79,89.79 v16.26,103.25
  Bottom 0.127: C10.2 6.22,16 6.22,16.89 7.87,18.54 7.87,18.92 R9.1 7.75,19.05 v7.75,19.94 | v7.75,21.72 7.75,22.99 IC9.4 | C4.2 24.89,103.5 24.38,104.01 16.76,104.01 D2.2 16.64,103.89 16.64,103.63 v16.26,103.25

### Text on the board
bPlace: -12V
bNames: 3.3V | SWDIO | SWCLK | GND